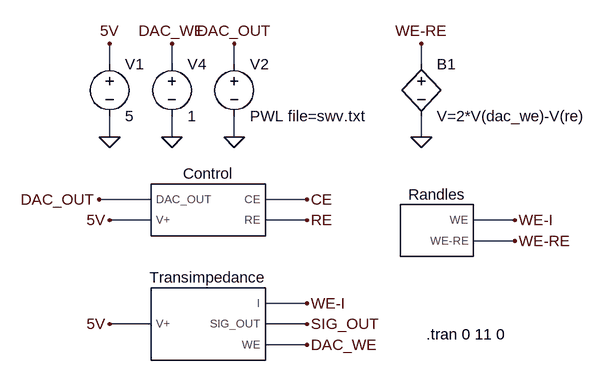
[diagram p0: schematic OPA2392_System.asc]
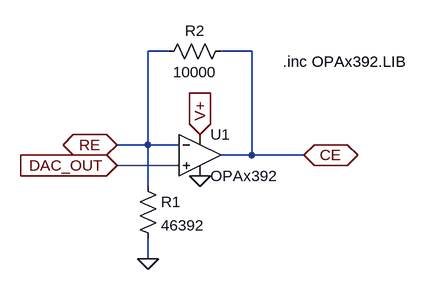
[diagram p1: sub-circuit opa2392_control_amp.asc]
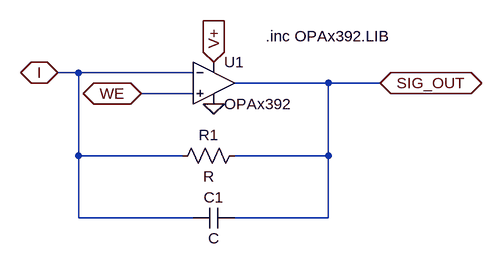
[diagram p2: sub-circuit opa2392_trans_amp.asc]
OPA2392_System.asc, the LTspice schematic file:
Version 4
SHEET 1 880 680
WIRE -192 -128 -192 -160
WIRE -96 -128 -96 -160
WIRE 0 -128 0 -160
WIRE 288 -128 288 -160
WIRE -192 -16 -192 -48
WIRE -96 -16 -96 -48
WIRE 0 -16 0 -48
WIRE 288 -16 288 -48
WIRE -128 80 -208 80
WIRE 112 80 48 80
WIRE -128 112 -192 112
WIRE 112 112 48 112
WIRE 432 112 368 112
WIRE 432 144 368 144
WIRE 112 240 48 240
WIRE -128 272 -192 272
WIRE 112 272 48 272
WIRE 112 304 48 304
FLAG -192 -16 0
FLAG -192 -160 5V
FLAG -192 112 5V
FLAG -192 272 5V
FLAG 0 -16 0
FLAG 0 -160 DAC_OUT
FLAG -208 80 DAC_OUT
FLAG 112 80 CE
FLAG 112 112 RE
FLAG 288 -160 WE-RE
FLAG 432 112 WE-I
FLAG 112 240 WE-I
FLAG 432 144 WE-RE
FLAG 112 272 SIG_OUT
FLAG -96 -16 0
FLAG -96 -160 DAC_WE
FLAG 112 304 DAC_WE
FLAG 288 -16 0
SYMBOL OPA2392_Control_Amp -48 96 R0
SYMATTR InstName Control
SYMBOL OPA2392_Trans_Amp -48 272 R0
SYMATTR InstName Transimpedance
SYMATTR SpiceLine R=47k C=17nF
SYMBOL Randles_Circuit 304 128 R0
SYMATTR InstName Randles
SYMBOL voltage -192 -144 R0
WINDOW 123 0 0 Left 0
WINDOW 39 0 0 Left 0
SYMATTR InstName V1
SYMATTR Value 5
SYMBOL voltage 0 -144 R0
WINDOW 123 0 0 Left 0
WINDOW 39 0 0 Left 0
SYMATTR InstName V2
SYMATTR Value PWL file=swv.txt
SYMBOL voltage -96 -144 R0
WINDOW 123 0 0 Left 0
WINDOW 39 0 0 Left 0
SYMATTR InstName V4
SYMATTR Value 1
SYMBOL bv 288 -144 R0
SYMATTR InstName B1
SYMATTR Value V=2*V(dac_we)-V(re)
TEXT 296 288 Left 2 !.tran 0 11 0

opa2392_control_amp.asc, the sub-circuit schematic file:
Version 4
SHEET 1 880 680
WIRE 240 -176 208 -176
WIRE 368 -176 320 -176
WIRE 208 -32 208 -176
WIRE 208 -32 160 -32
WIRE 256 -32 208 -32
WIRE 368 -16 368 -176
WIRE 368 -16 320 -16
WIRE 448 -16 368 -16
WIRE 256 0 160 0
WIRE 208 32 208 -32
WIRE 208 144 208 112
FLAG 288 -48 V+
IOPIN 288 -48 In
FLAG 288 16 0
FLAG 160 0 DAC_OUT
IOPIN 160 0 In
FLAG 160 -32 RE
IOPIN 160 -32 BiDir
FLAG 208 144 0
FLAG 448 -16 CE
IOPIN 448 -16 BiDir
SYMBOL OpAmps\\opamp2 288 -80 R0
SYMATTR InstName U1
SYMATTR Value OPAx392
SYMBOL res 192 16 R0
SYMATTR InstName R1
SYMATTR Value 46392
SYMBOL res 336 -192 R90
WINDOW 0 0 56 VBottom 2
WINDOW 3 32 56 VTop 2
SYMATTR InstName R2
SYMATTR Value 10000
TEXT 416 -160 Left 2 !.inc OPAx392.LIB

opa2392_trans_amp.asc, the sub-circuit schematic file:
Version 4
SHEET 1 880 680
WIRE 32 144 0 144
WIRE 208 144 32 144
WIRE 416 160 272 160
WIRE 496 160 416 160
WIRE 208 176 128 176
WIRE 32 272 32 144
WIRE 192 272 32 272
WIRE 416 272 416 160
WIRE 416 272 272 272
WIRE 32 368 32 272
WIRE 208 368 32 368
WIRE 416 368 416 272
WIRE 416 368 272 368
FLAG 240 192 0
FLAG 240 128 V+
IOPIN 240 128 In
FLAG 128 176 WE
IOPIN 128 176 BiDir
FLAG 0 144 I
IOPIN 0 144 BiDir
FLAG 496 160 SIG_OUT
IOPIN 496 160 BiDir
SYMBOL OpAmps\\opamp2 240 96 R0
SYMATTR InstName U1
SYMATTR Value OPAx392
SYMBOL res 288 256 R90
WINDOW 0 0 56 VBottom 2
WINDOW 3 32 56 VTop 2
SYMATTR InstName R1
SYMBOL cap 272 352 R90
WINDOW 0 0 32 VBottom 2
WINDOW 3 32 32 VTop 2
SYMATTR InstName C1
TEXT 320 88 Left 2 !.inc OPAx392.LIB

The netlist it stands for:
* OPA2392_System.asc
XControl DAC_OUT 5V CE RE opa2392_control_amp
XTransimpedance 5V WE-I SIG_OUT DAC_WE opa2392_trans_amp params: R=47k C=17nF
XRandles WE-I WE-RE Randles_Circuit  ; pins WE WE-RE
V1 5V 0 5
V2 DAC_OUT 0 PWL file=swv.txt
V4 DAC_WE 0 1
B1 WE-RE 0 V=2*V(dac_we)-V(re)

* block symbol definitions
.subckt opa2392_control_amp DAC_OUT V+ CE RE
XU1 DAC_OUT RE V+ 0 CE OPAx392  ; pins In+ In- V+ V- OUT
R1 RE 0 46392
R2 CE RE 10000
.inc OPAx392.LIB
.ends opa2392_control_amp

.subckt opa2392_trans_amp V+ I SIG_OUT WE
XU1 WE I V+ 0 SIG_OUT OPAx392  ; pins In+ In- V+ V- OUT
R1 SIG_OUT I R
C1 SIG_OUT I C
.inc OPAx392.LIB
.ends opa2392_trans_amp

.tran 0 11 0
.backanno
.end

* Results of the author's LTspice run, read from the files saved beside the schematic
* Operating Point, zero values left out:
*   V(ce) = 1.246 V
*   V(5v) = 5 V
*   V(re) = 1.025 V
*   V(dac_out) = 1.025 V
*   V(sig_out) = 1 V
*   V(we-i) = 1 V
*   V(dac_we) = 1 V
*   V(we-re) = 975 mV
*   I(B1) = 457.1 nA
*   I(V1) = -2.463 mA
*   I(V2) = 5.91 pA
*   I(V4) = 6.01 pA
*   Ix(control:CE) = 22.09 µA
*   Ix(control:RE) = 5.92 pA
*   Ix(transimpedance:I) = -457.1 nA
*   Ix(transimpedance:SIG_OUT) = 457.1 nA
*   Ix(randles:WE) = 457.1 nA
*   Ix(randles:WE-RE) = -457.1 nA
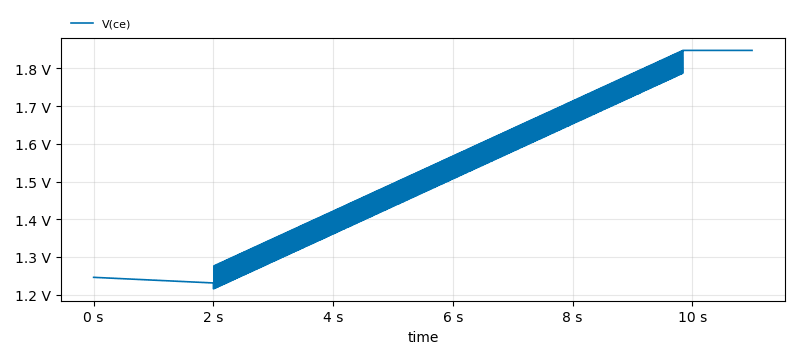
[diagram p3: Transient Analysis of OPA2392_System.asc, plotted from the saved traces]
* Transient Analysis, 1 run:
*   V(ce): min 1.215 V, max 1.848 V, average 1.513 V, rms 1.528 V, last 1.848 V